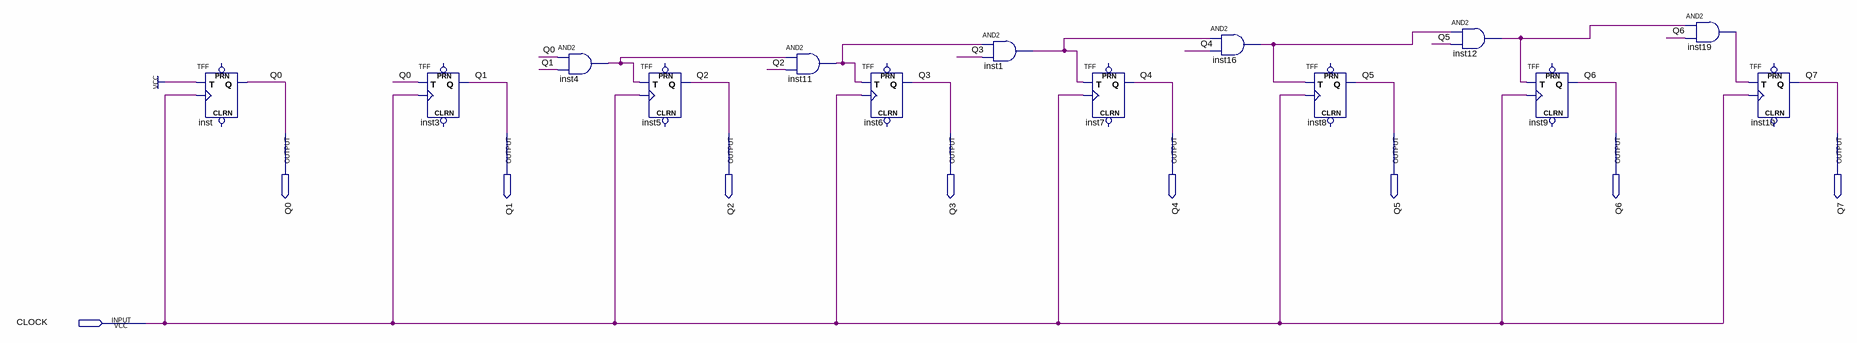
[diagram p0: schematic sheet]
// Quartus schematic Cont8Bits.bdf as structural Verilog: 14 symbols, 9 pins
module Cont8Bits (
  input  CLOCK,
  output Q0,
  output Q1,
  output Q2,
  output Q3,
  output Q4,
  output Q5,
  output Q6,
  output Q7
);

  wire inst1_out, inst4_out, inst11_out, inst12_out, inst16_out, inst19_out;

  TFF inst (.T(1'b1), .CLK(CLOCK), .Q(Q0));  // open: PRN, CLRN
  TFF inst3 (.T(Q0), .CLK(CLOCK), .Q(Q1));  // open: PRN, CLRN
  and inst4 (inst4_out, Q0, Q1);
  TFF inst5 (.T(inst4_out), .CLK(CLOCK), .Q(Q2));  // open: PRN, CLRN
  and inst11 (inst11_out, inst4_out, Q2);
  TFF inst6 (.T(inst11_out), .CLK(CLOCK), .Q(Q3));  // open: PRN, CLRN
  and inst1 (inst1_out, inst11_out, Q3);
  TFF inst7 (.T(inst1_out), .CLK(CLOCK), .Q(Q4));  // open: PRN, CLRN
  and inst16 (inst16_out, inst1_out, Q4);
  TFF inst8 (.T(inst16_out), .CLK(CLOCK), .Q(Q5));  // open: PRN, CLRN
  and inst12 (inst12_out, inst16_out, Q5);
  TFF inst9 (.T(inst12_out), .CLK(CLOCK), .Q(Q6));  // open: PRN, CLRN
  and inst19 (inst19_out, inst12_out, Q6);
  TFF inst10 (.T(inst19_out), .CLK(CLOCK), .Q(Q7));  // open: PRN, CLRN
endmodule
